# EAGLE design MMA7455L-v12 (EAGLE 6.2)
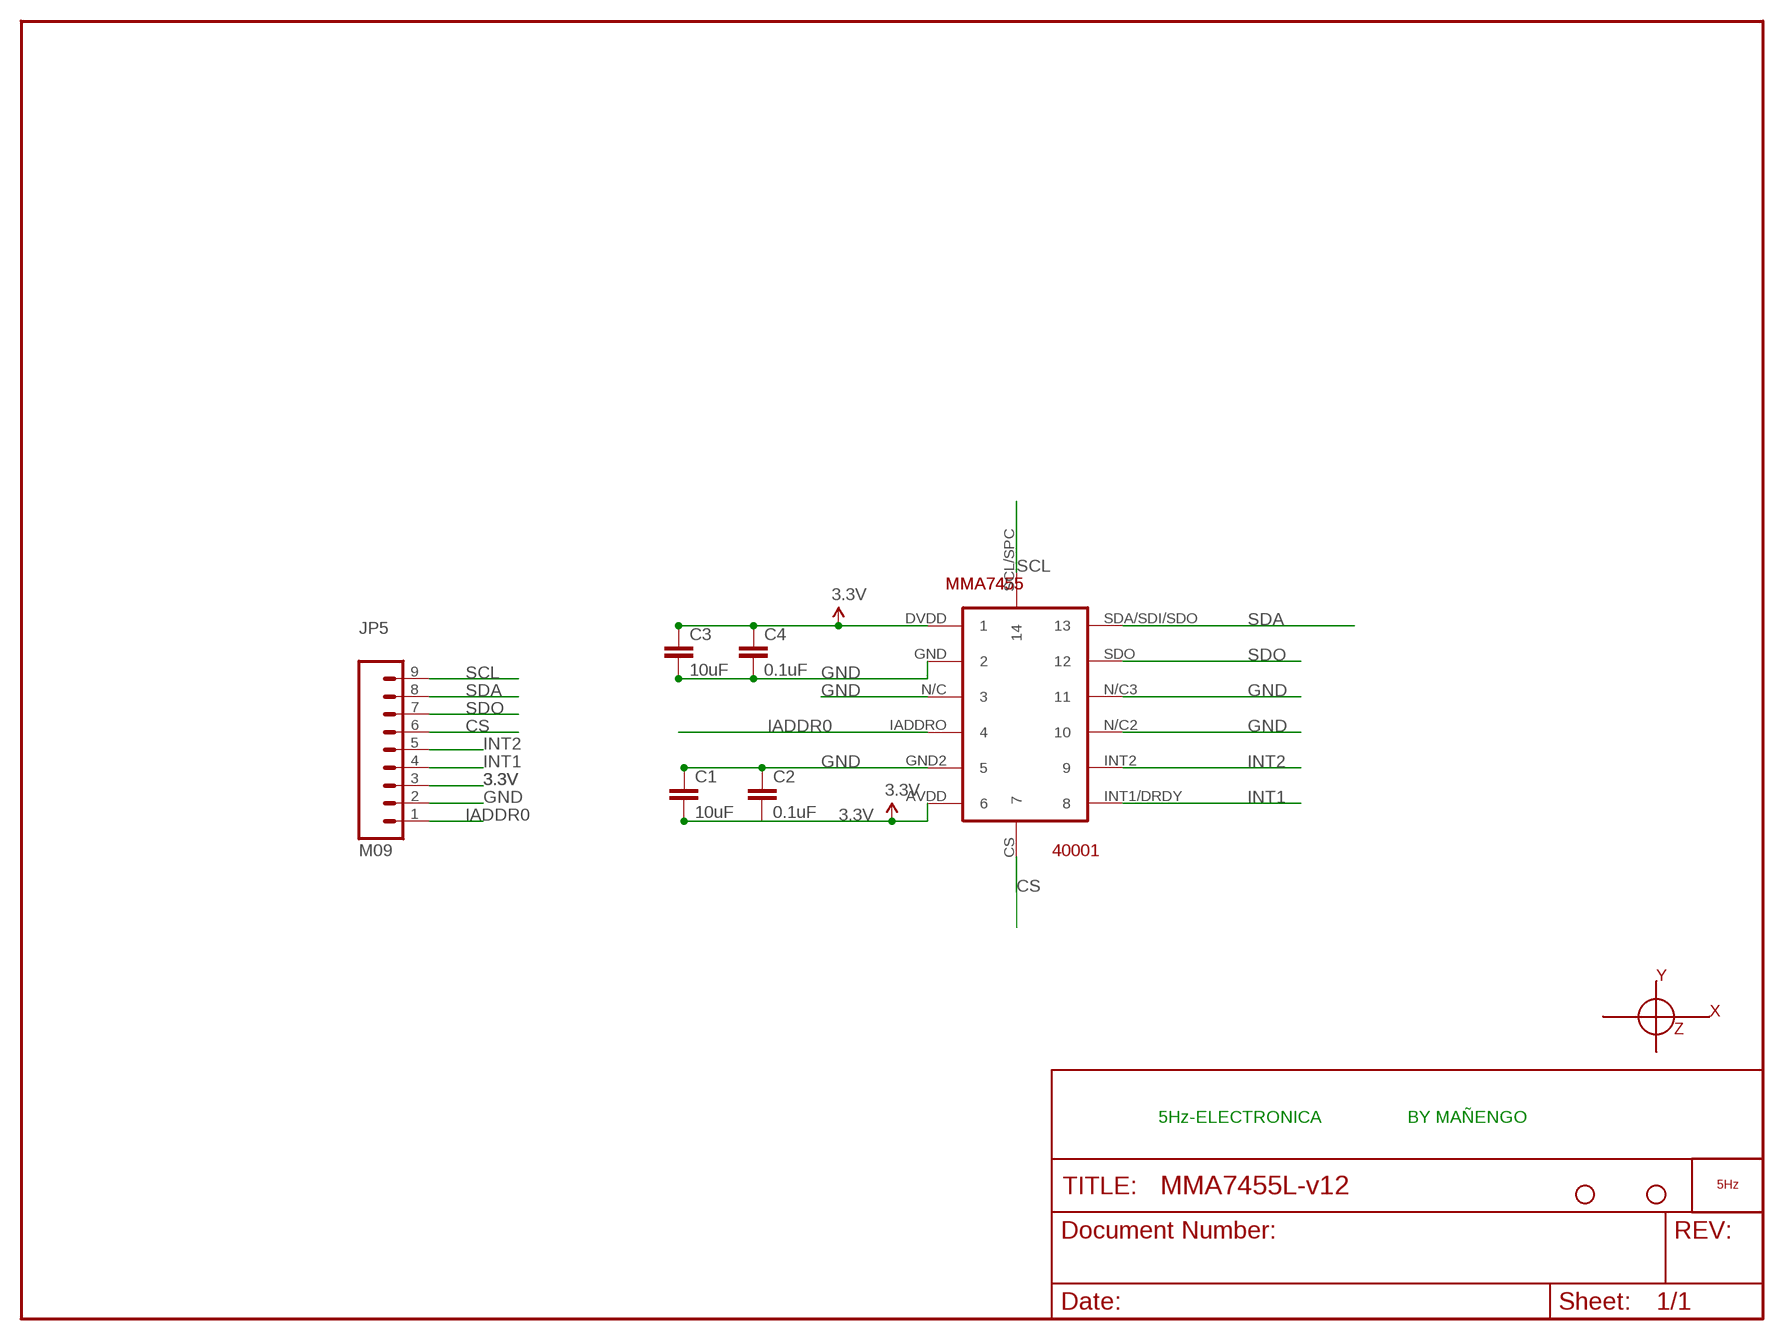
[diagram p0: schematic, sheet 1]

## Parts
C1  10uF  CAP0603-CAP  [0603-CAP]
C2  0.1uF  CAP0603-CAP  [0603-CAP]
C3  10uF  CAP0603-CAP  [0603-CAP]
C4  0.1uF  CAP0603-CAP  [0603-CAP]
JP3  STAND-OFF  [STAND-OFF]
JP4  STAND-OFF  [STAND-OFF]
JP5  M09  [1X09]
LOGO1  LOGO_5HZ_H_10MM  [5HZ_LOGO_H_10MM]
MMA7455  40001  MMA7455L  [MMA7455L]
U$3  EJES_CARTESIANO_5MM  [EJE_CARTESIANO_5MM]

## Nets
3.3V: C1.2 C2.2 C3.1 C4.1 JP5.3 MMA7455.AVDD MMA7455.DVDD
CS: JP5.6 MMA7455.CS
GND: C1.1 C2.1 C3.2 C4.2 JP5.2 MMA7455.GND MMA7455.GND2 MMA7455.N/C MMA7455.N/C2 MMA7455.N/C3
IADDR0: JP5.1 MMA7455.IADDRO
INT1: JP5.4 MMA7455.INT1/DRDY
INT2: JP5.5 MMA7455.INT2
SCL: JP5.9 MMA7455.SCL/SPC
SDA: JP5.8 MMA7455.SDA/SDI/SDO
SDO: JP5.7 MMA7455.SDO

## Notes on the sheet
- 5Hz-ELECTRONICA | BY MAÑENGO

## Library data of the parts
C1-C4 = SparkFun:CAP: Capacitor Standard 0603 ceramic capacitor, and 0.1" leaded capacitor.
JP3 JP4 = SparkFun:STAND-OFF: Stand Off This is the mechanical footprint for a #4 phillips button head screw. Use the keepout ring to avoid running the screw head into surrounding components. SKU : PRT-00447
JP5 = SparkFun:M09: Header 9 Standard 9-pin 0.1" header. Use with straight break away headers (SKU : PRT-00116), right angle break away headers (PRT-00553), swiss pins (PRT-00743), machine pins (PRT-00117), and female headers (PRT-00115).
LOGO1 = 5hz-electronica:LOGO_5HZ: Logotipo 5Hz "según Pedro"
MMA7455 = accelerometer:MMA7455L
U$3 = PEDRO:EJES

## Board
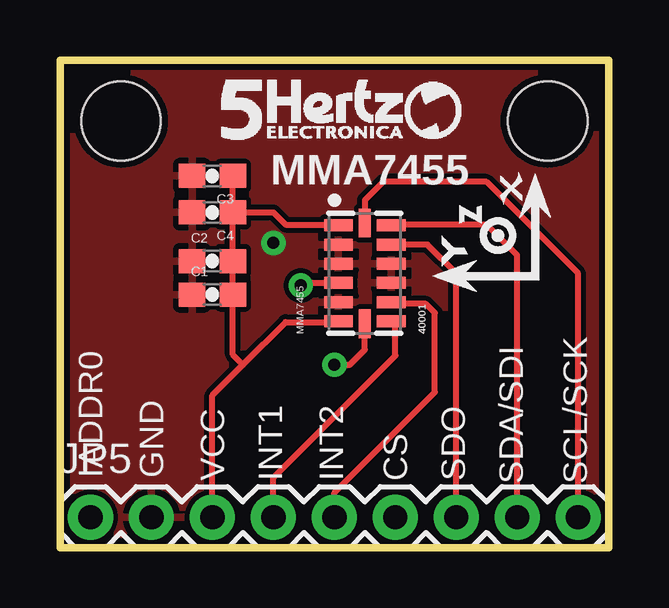
[diagram p1: board, top side]
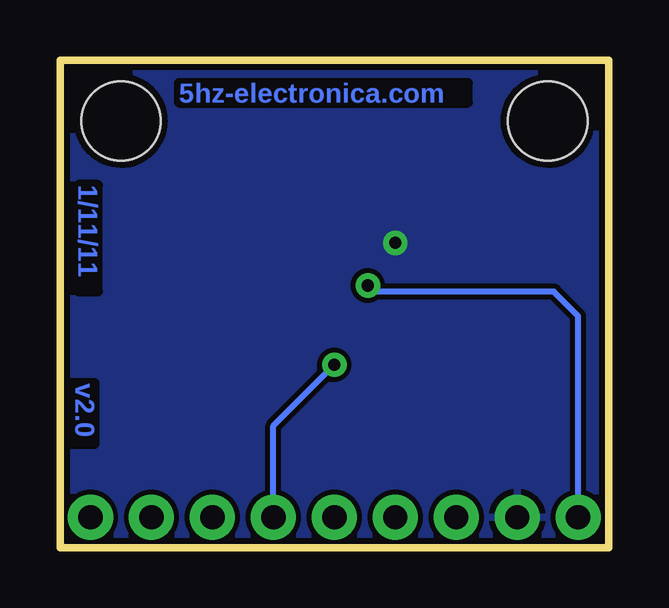
[diagram p2: board, bottom side, seen from below]

Size 22.86 x 20.32 mm. Coordinates in mm from the lower left corner, seen from the top.
Outline: 0,0 22.86,0 22.86,20.32 0,20.32 0,0
Copper layers (1*16): Top 0.035mm / dielectric 1.5mm / Bottom 0.035mm
Design rules: minimum track width 8mil, minimum drill 20mil, track to track 8mil, track to pad 8mil, pad to pad 8mil, via to via 8mil, smd to smd 8mil, copper to edge 10mil, drill to drill 8mil, minimum pad ring 12mil, minimum via ring 10mil, stop-mask expansion 4mil, vias tented up to drill 25mil, thermal gap 10mil

### Footprints (pad centres in the part's own frame; a part is rotated, then mirrored left to right if it is on the bottom)
0603-CAP = smd 1.1 x 1: 1 -0.85,0; 2 0.85,0
STAND-OFF = hole 3.302: 0,0
1X09 = drill 1.016 pad 1.88: 1 0,0; 2 2.54,0; 3 5.08,0; 4 7.62,0; 5 10.16,0; 6 12.7,0; 7 15.24,0; 8 17.78,0; 9 20.32,0
MMA7455L = smd 0.5 x 1.2: AVDD -2,1.1; DVDD 2,1.1; GND 1.2,1.1; GND2 -1.2,1.1; IADDRO -0.4,1.1; INT1/DRDY -2,-1.1; INT2 -1.2,-1.1; N/C 0.4,1.1; N/C2 -0.4,-1.1; N/C3 0.4,-1.1; SDA/SDI/SDO 2,-1.1; SDO 1.2,-1.1 | smd 1.2 x 0.5: CS -2.1,0; SCL/SPC 2.1,0

### Placement (x,y rotation side)
C1  6.35,10.54 0 top
C2  6.35,11.94 0 top
C3  6.35,15.49 180 top
C4  6.35,13.97 180 top
JP3  2.54,17.78 0 top
JP4  20.32,17.78 0 top
JP5  1.27,1.27 0 top
LOGO1  6.73,17.02 0 top
MMA7455  12.7,11.43 90 top
U$3  20.45,10.67 90 top

### Tracks (layer width: path | path; a pad name or v marks a point on that pad's centre or on a via)
3.3V
  Top 0.254: MMA7455.AVDD 11.57,9.4 9.4,9.4 7.62,7.62 | C4.1 C3.1 | MMA7455.DVDD 11.57,13.46 9.4,13.46 8.89,13.97 C4.1 | 7.62,7.62 6.35,6.35 JP5.3 | C4.1 C2.2 C1.2 7.2,8.04 7.62,7.62
CS  (via drill 0.51)
  Top 0.254: 12.83,9.2 MMA7455.CS 12.7,8.26 12.06,7.62 v11.43,7.62
  Bottom 0.254: v11.43,7.62 13.97,5.08 JP5.6
GND  (via drill 0.51)
  other vias: 8.89,12.7
  pour Bottom: 0,20.32 22.86,20.32 22.86,0 0,0
  pour Top: 0,20.32 22.86,20.32 22.86,0 0,0
IADDR0  (via drill 0.51)
  Top 0.254: MMA7455.IADDRO 10.14,11.03 v10.03,10.92
  Bottom 0.254: v10.03,10.92 9.78,10.67 2.29,10.67 1.27,9.65 JP5.1
INT1
  Top 0.254: MMA7455.INT1/DRDY 13.97,9.26 13.97,8 8.89,2.92 JP5.4
INT2
  Top 0.254: MMA7455.INT2 13.87,10.16 15.24,10.16 15.62,9.78 15.62,6.48 11.43,2.29 JP5.5
N$2  (via drill 0.51)
  other vias: 11.43,7.62
SCL
  Top 0.254: MMA7455.SCL/SPC 12.7,14.48 13.46,15.24 17.78,15.24 21.59,11.43 JP5.9
SDA
  Top 0.254: MMA7455.SDA/SDI/SDO 13.83,13.46 17.78,13.46 19.05,12.19 JP5.8
SDO
  Top 0.254: MMA7455.SDO 15.31,12.63 16.51,11.43 JP5.7

### Text on the board
Bottom: 5hz-electronica.com | 1/11/11 | v2.0
tPlace: MMA7455 | IADDR0 | GND | VCC | INT1 | INT2 | CS | SDO | SDA/SDI | SCL/SCK